# EasyEDA Pro project ProPrj_10MHzEOM_2025-06-26.epro

# Schematic 50OhmLNetwork_10MHz
Board Name: Board1; Create Date: 2025-06-18; Page Name: P1; Project Name: 10MHzEOM; Schematic Name: 50OhmLNetwork_10MHz; Update Date: 2025-06-24; Company: EasyEDA.com; Page Size: A4; Version: V1.0
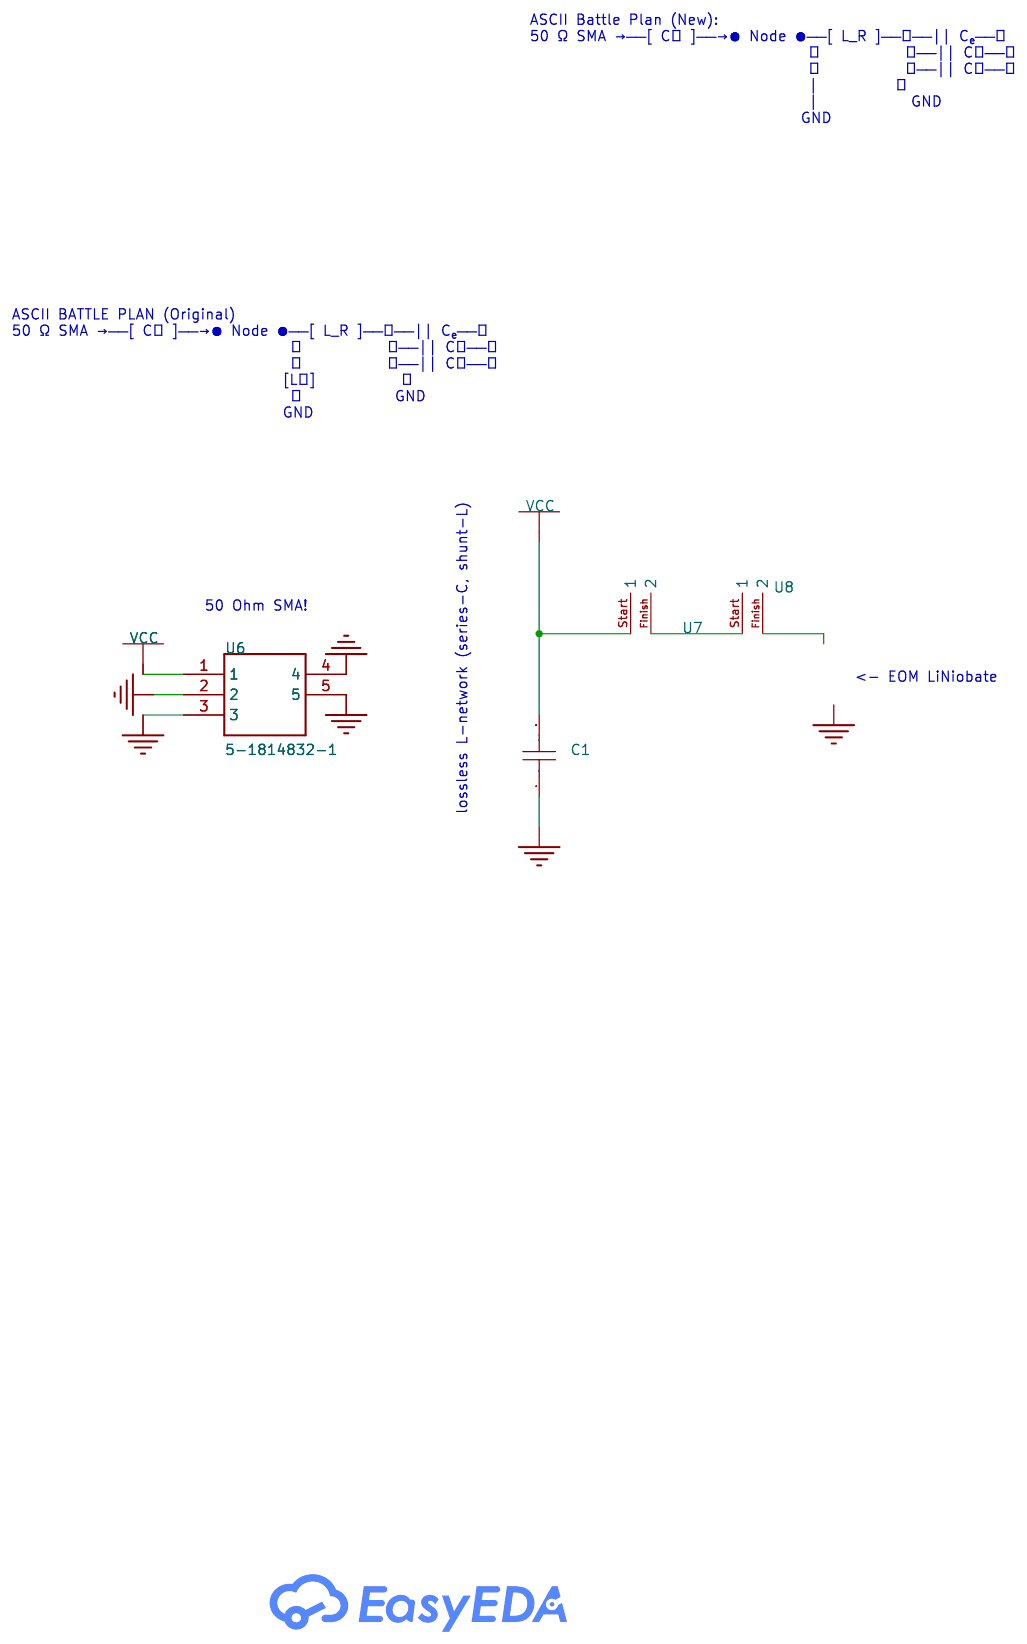
[diagram p0: schematic sheet]

## Parts
C1  10nF  [C0805]
U6  5-1814832-1  [5-1814832-1]
U7  -  [146-08J08L Adjustable]
U8  -  [1812CS-682]

## Library data of the parts
C1 = 0805B103K101NT: Temperature Coefficient: Tolerance: Tolerance: Voltage Rated: Capacitance:; LCSC Part Name: 10nF(103) ±10% 100V; Supplier Part: C128805; Manufacturer: FH(风华); Supplier Footprint: 0805; JLCPCB Part Class: Extended Part; Datasheet: https://atta.szlcsc.com/upload/public/pdf/source/20170923/C128805_1506149252958988325.pdf; Supplier: LCSC
U6 = 5-1814832-1: TSW-115-08-G-D-RA
U7 = 146-08J08L Adjustable Inductor: 146-08J08L / https://www.coilcraft.com/en-us/products/rf/tunable-rf-inductors/vertical-mount/uni7/146-08j08l/
U8 = 1812CS-682

## Nets
GND: C1.1 U6.2 U6.3 U6.4 U6.5
VCC: C1.2 U6.1 U7.Start(1)
Net-(U7-Finish): U7.Finish(2) U8.Start(1)

Not connected (* = marked no-connect by the designer): U8 Finish(2)

## Notes on the sheet
- ASCII Battle Plan (New):
  50 Ω SMA →──[ Cₘ ]──→● Node ●──[ L_R ]──┬──|| Cₑ──┐
                                      │           ├──|| Cₚ──┤
                                      │           └──|| Cₜ──┘
                                      |          │
                                      |            GND
                                     GND
- ASCII BATTLE PLAN (Original)
  50 Ω SMA →──[ Cₘ ]──→● Node ●──[ L_R ]──┬──|| Cₑ──┐
                                      │           ├──|| Cₚ──┤
                                      │           └──|| Cₜ──┘
                                     [Lₘ]           │
                                      │            GND
                                     GND
- 50 Ohm SMA!
- <- EOM LiNiobate
- lossless L-network (series-C, shunt-L)

# Board PCB1
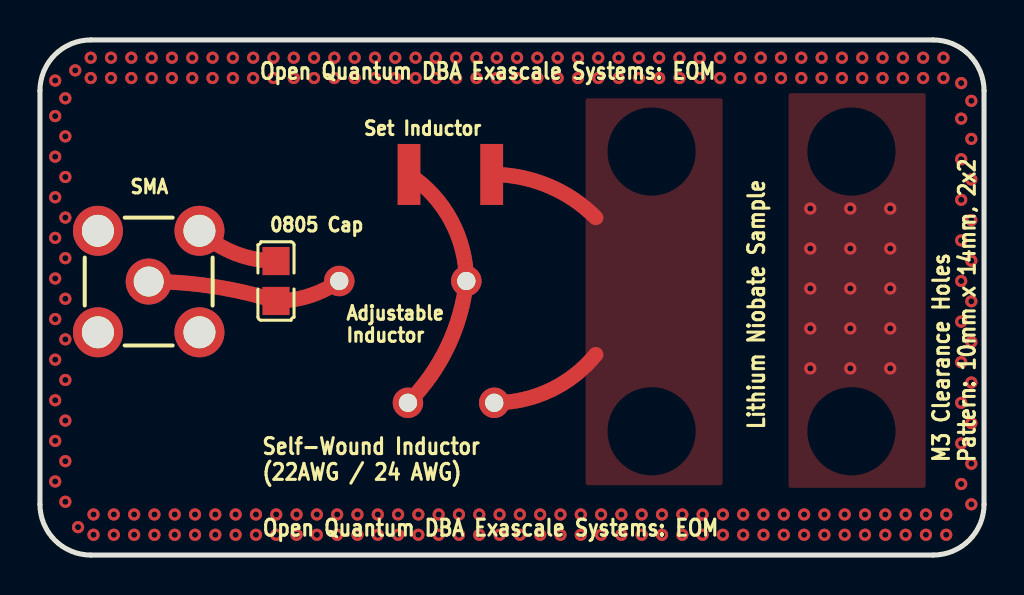
[diagram p1: board, top side]
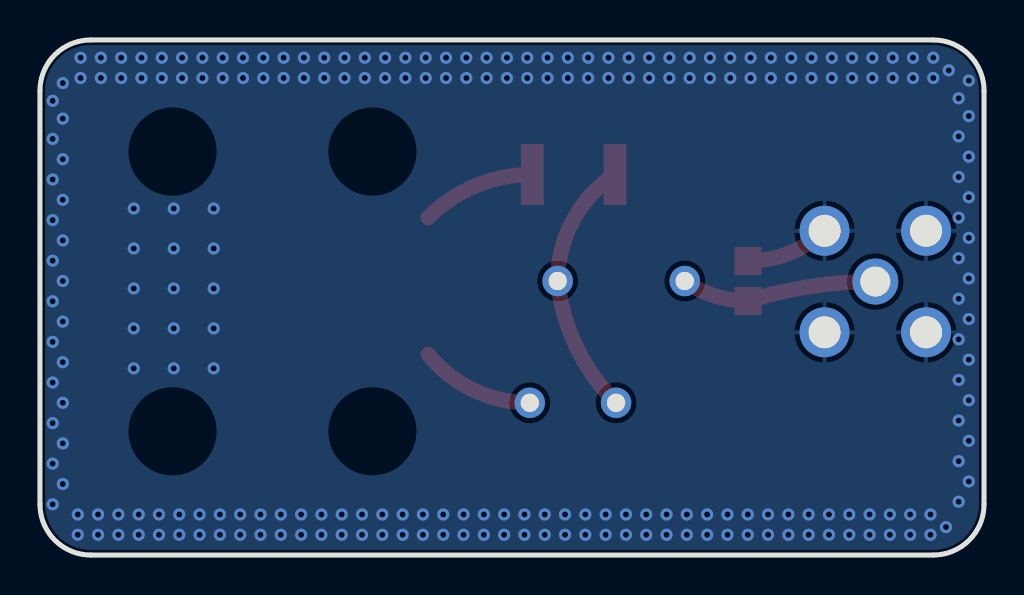
[diagram p2: board, bottom side, seen from below]

Outline 47.24 x 25.78 mm; copper layers: Top Layer, Inner1, Inner2, Bottom Layer. Coordinates in mm from the lower left corner of the outline.
Outline path: 0,23.24 0,2.54 arc(0.74,0.74) 2.54,0 44.7,0 arc(46.5,0.74) 47.24,2.54 47.24,23.24 arc(46.5,25.04) 44.7,25.78 2.54,25.78 arc(0.74,25.04) 0,23.24
Stack: Top Layer 0.035mm Outer layer thickness 1oz / Dielectric1 0.2104mm 7628 RC49% 8.6mil / Inner1 0.0152mm Inner layer thickness / Dielectric2 1.065mm 1.1mm H/HOZ Copper / Inner2 0.0152mm Inner layer thickness / Dielectric3 0.2104mm 7628 RC49% 8.6mil / Bottom Layer 0.035mm Outer layer thickness 1oz

## Design rules (mm)
template: JLCPCB Capability(Two Layers Board)
spacing copperThickness1oz (default): track to track 0.102, other pairs 0.152 to 0.3
spacing copperThickness2oz: track to track 0.203, other pairs 0.152 to 0.3
track width copperThickness1oz (default): min 0.127, default 0.254, max 2.54
track width copperThickness2oz: min 0.203, default 0.254, max 2.54
differential pair differentialPair (default): width min 0.127, default 0.254, max 2.54; gap min 0.152, default 0.152
via viaSize (default): diameter min 0.5, default 0.61, max 10; hole min 0.3, default 0.305, max 6.3

## Placement (name value [footprint] x y rotation side)
0805 Cap  -  [C0805]  11.81 13.72 270 top
Adjustable 
Inductor  -  [146-08J08L Adjustable]  22.35 14.6 180 top
NOREF  -  [Pad_e459]  22.73 7.62 0 top
NOREF#2  -  [Pad_e420]  18.42 7.62 0 top
Set Inductor  -  [1812CS-682]  19.05 21.84 270 top
SMA  -  [5-1814832-1]  5.44 13.69 0 top

## Footprints (pads in the part's own frame, mm; a bottom-side part is the same pattern mirrored in y, then rotated)
5-1814832-1
  round 2.3 hole 1.5: 1(0,0)
  round 2.5 hole 1.6: 2(-2.54,-2.54) 3(2.54,-2.54) 4(2.54,2.54) 5(-2.54,2.54)
146-08J08L Adjustable
  round 1.524 hole 0.914x0.7: 1(1.016,0.889) 2(7.374,0.889)
1812CS-682
  rect 3.05x1.14 smd: 1(2.794,3.556) 2(2.794,-0.584)
C0805
  rect 1.41x1.35 smd: 1(-1,0) 2(1,0)
Pad_e420
  round 1.524 hole 0.914: 1(0,0)
Pad_e459
  round 1.524 hole 0.914: 1(0,0)

## Nets
GND: 0805 Cap.1 SMA.2 SMA.3 SMA.4 SMA.5
VCC: 0805 Cap.2 Adjustable 
Inductor.2 SMA.1

Pads without a net: Adjustable 
Inductor 1; NOREF 1; NOREF#2 1; Set Inductor 1 2

## Via types
v1: diameter 0.61, hole 0.305, Top Layer to Bottom Layer, 233 vias

## Routing (per net, layer and track width the routed paths; a pad name or vN(x,y) marks a point on that pad's centre or on a via; arc(x,y) is an arc through that point)
GND: length 4.2
  Top Layer w0.762: 0805 Cap.1 arc(9.75,15.11) SMA.4
  vias: v1(0.76,23.75) v1(0.76,21.97) v1(0.76,19.94) v1(0.76,17.91) v1(0.76,15.88) v1(0.76,13.84) v1(0.76,11.81) v1(0.76,9.78) v1(0.76,7.75) v1(0.76,5.71) v1(0.76,3.68) v1(1.27,22.86) v1(1.27,20.95) v1(1.27,18.92) v1(1.27,16.89) v1(1.27,14.86) v1(1.27,12.83) v1(1.27,10.8) v1(1.27,8.76) v1(1.27,6.73) v1(1.27,4.7) v1(1.27,2.67) v1(1.77,24.26) v1(1.91,1.4) v1(2.54,24.89) v1(2.54,23.88) v1(2.68,2.03) v1(2.68,1.01) v1(3.56,24.89) v1(3.56,23.88) v1(3.7,2.03) v1(3.7,1.01) v1(4.57,24.89) v1(4.57,23.88) v1(4.71,2.03) v1(4.71,1.01) v1(5.59,24.89) v1(5.59,23.88) v1(5.73,2.03) v1(5.73,1.01) v1(6.6,24.89) v1(6.6,23.88) v1(6.74,2.03) v1(6.74,1.01) v1(7.62,24.89) v1(7.62,23.88) v1(7.76,2.03) v1(7.76,1.01) v1(8.64,24.89) v1(8.64,23.88) v1(8.78,2.03) v1(8.78,1.01) v1(9.65,24.89) v1(9.65,23.88) v1(9.79,2.03) v1(9.79,1.01) v1(10.67,24.89) v1(10.67,23.88) v1(10.81,2.03) v1(10.81,1.01) v1(11.68,24.89) v1(11.68,23.88) v1(11.82,2.03) v1(11.82,1.01) v1(12.7,24.89) v1(12.7,23.88) v1(12.84,2.03) v1(12.84,1.01) v1(13.72,24.89) v1(13.72,23.88) v1(13.86,2.03) v1(13.86,1.01) v1(14.73,24.89) v1(14.73,23.88) v1(14.87,2.03) v1(14.87,1.01) v1(15.75,24.89) v1(15.75,23.88) v1(15.89,2.03) v1(15.89,1.01) v1(16.76,24.89) v1(16.76,23.88) v1(16.9,2.03) v1(16.9,1.01) v1(17.78,24.89) v1(17.78,23.88) v1(17.92,2.03) v1(17.92,1.01) v1(18.8,24.89) v1(18.8,23.88) v1(18.94,2.03) v1(18.94,1.01) v1(19.81,24.89) v1(19.81,23.88) v1(19.95,2.03) v1(19.95,1.01) v1(20.83,24.89) v1(20.83,23.88) v1(20.97,2.03) v1(20.97,1.01) v1(21.84,24.89) v1(21.84,23.88) v1(21.98,2.03) v1(21.98,1.01) v1(22.86,24.89) v1(22.86,23.88) v1(23,2.03) v1(23,1.01) v1(23.88,24.89) v1(23.88,23.88) v1(24.02,2.03) v1(24.02,1.01) v1(24.89,24.89) v1(24.89,23.88) v1(25.03,2.03) v1(25.03,1.01) v1(25.91,24.89) v1(25.91,23.88) v1(26.05,2.03) v1(26.05,1.01) v1(26.92,24.89) v1(26.92,23.88) v1(27.06,2.03) v1(27.06,1.01) v1(27.94,24.89) v1(27.94,23.88) v1(28.08,2.03) v1(28.08,1.01) v1(28.96,24.89) v1(28.96,23.88) v1(29.1,2.03) v1(29.1,1.01) v1(29.97,24.89) v1(29.97,23.88) v1(30.11,2.03) v1(30.11,1.01) v1(30.99,24.89) v1(30.99,23.88) v1(31.13,2.03) v1(31.13,1.01) v1(32,24.89) v1(32,23.88) v1(32.14,2.03) v1(32.14,1.01) v1(33.02,24.89) v1(33.02,23.88) v1(33.16,2.03) v1(33.16,1.01) v1(34.04,24.89) v1(34.04,23.88) v1(34.18,2.03) v1(34.18,1.01) v1(35.05,24.89) v1(35.05,23.88) v1(35.19,2.03) v1(35.19,1.01) v1(36.07,24.89) v1(36.07,23.88) v1(36.21,2.03) v1(36.21,1.01) v1(37.08,24.89) v1(37.08,23.88) v1(37.22,2.03) v1(37.22,1.01) v1(38.1,24.89) v1(38.1,23.88) v1(38.24,2.03) v1(38.24,1.01) v1(38.55,17.34) v1(38.55,15.34) v1(38.55,13.34) v1(38.55,11.34) v1(38.55,9.34) v1(39.12,24.89) v1(39.12,23.88) v1(39.26,2.03) v1(39.26,1.01) v1(40.13,24.89) v1(40.13,23.88) v1(40.27,2.03) v1(40.27,1.01) v1(40.55,17.34) v1(40.55,15.34) v1(40.55,13.34) v1(40.55,11.34) v1(40.55,9.34) v1(41.15,24.89) v1(41.15,23.88) v1(41.29,2.03) v1(41.29,1.01) v1(42.16,24.89) v1(42.16,23.88) v1(42.3,2.03) v1(42.3,1.01) v1(42.55,17.34) v1(42.55,15.34) v1(42.55,13.34) v1(42.55,11.34) v1(42.55,9.34) v1(43.18,24.89) v1(43.18,23.88) v1(43.32,2.03) v1(43.32,1.01) v1(44.2,24.89) v1(44.2,23.88) v1(44.34,2.03) v1(44.34,1.01) v1(45.21,24.89) v1(45.21,23.88) v1(45.35,2.03) v1(45.35,1.01) v1(46.1,23.62) v1(46.1,21.84) v1(46.1,19.81) v1(46.1,17.78) v1(46.1,15.75) v1(46.1,13.72) v1(46.1,11.68) v1(46.1,9.65) v1(46.1,7.62) v1(46.1,5.59) v1(46.1,3.56) v1(46.61,22.73) v1(46.61,20.83) v1(46.61,18.8) v1(46.61,16.76) v1(46.61,14.73) v1(46.61,12.7) v1(46.61,10.67) v1(46.61,8.64) v1(46.61,6.6) v1(46.61,4.57) v1(46.61,2.54)
VCC: length 9.8
  Top Layer w0.762: Adjustable 
Inductor.2 arc(13.47,12.97) 0805 Cap.2 arc(8.66,13.44) SMA.1
(no net): length 24.8
  Top Layer w0.762: Set Inductor.1 arc(25.42,18.49) 27.81,16.89 ; Set Inductor.2 arc(20.57,16.74) Adjustable 
Inductor.1 arc(20.4,10.42) NOREF#2.1 ; NOREF.1 arc(25.54,8.25) 27.81,10.03

## Copper pours and planes (outline as drawn; the poured copper is in the pictures)
GND on Top Layer: 37.47,23.11 44.32,23.11 44.32,3.37 37.47,3.37
GND on Bottom Layer: -0.25,27.43 51.56,27.43 51.56,-0.64 -0.25,-0.64
GND on Inner1: -1.78,26.03 50.29,26.03 50.29,-0.64 -1.78,-0.64
(no net) on Top Layer: 27.31,22.86 34.16,22.86 34.16,3.49 27.31,3.49

## Text on the board
Top Silkscreen Layer: Open Quantum DBA Exascale Systems: EOM | Self-Wound Inductor / (22AWG / 24 AWG) | Lithium Niobate Sample | M3 Clearance Holes / Pattern: 10mm x 14mm, 2x2
